# EAGLE schematic fmc-to-vhcdi (EAGLE 8.3.2)
DESIGNER: JON NEWMAN; DESIGN_NAME: FMC TO VHCDI; LICENSE: CC BY-NC-SA 4.0; REVISION: 1.0
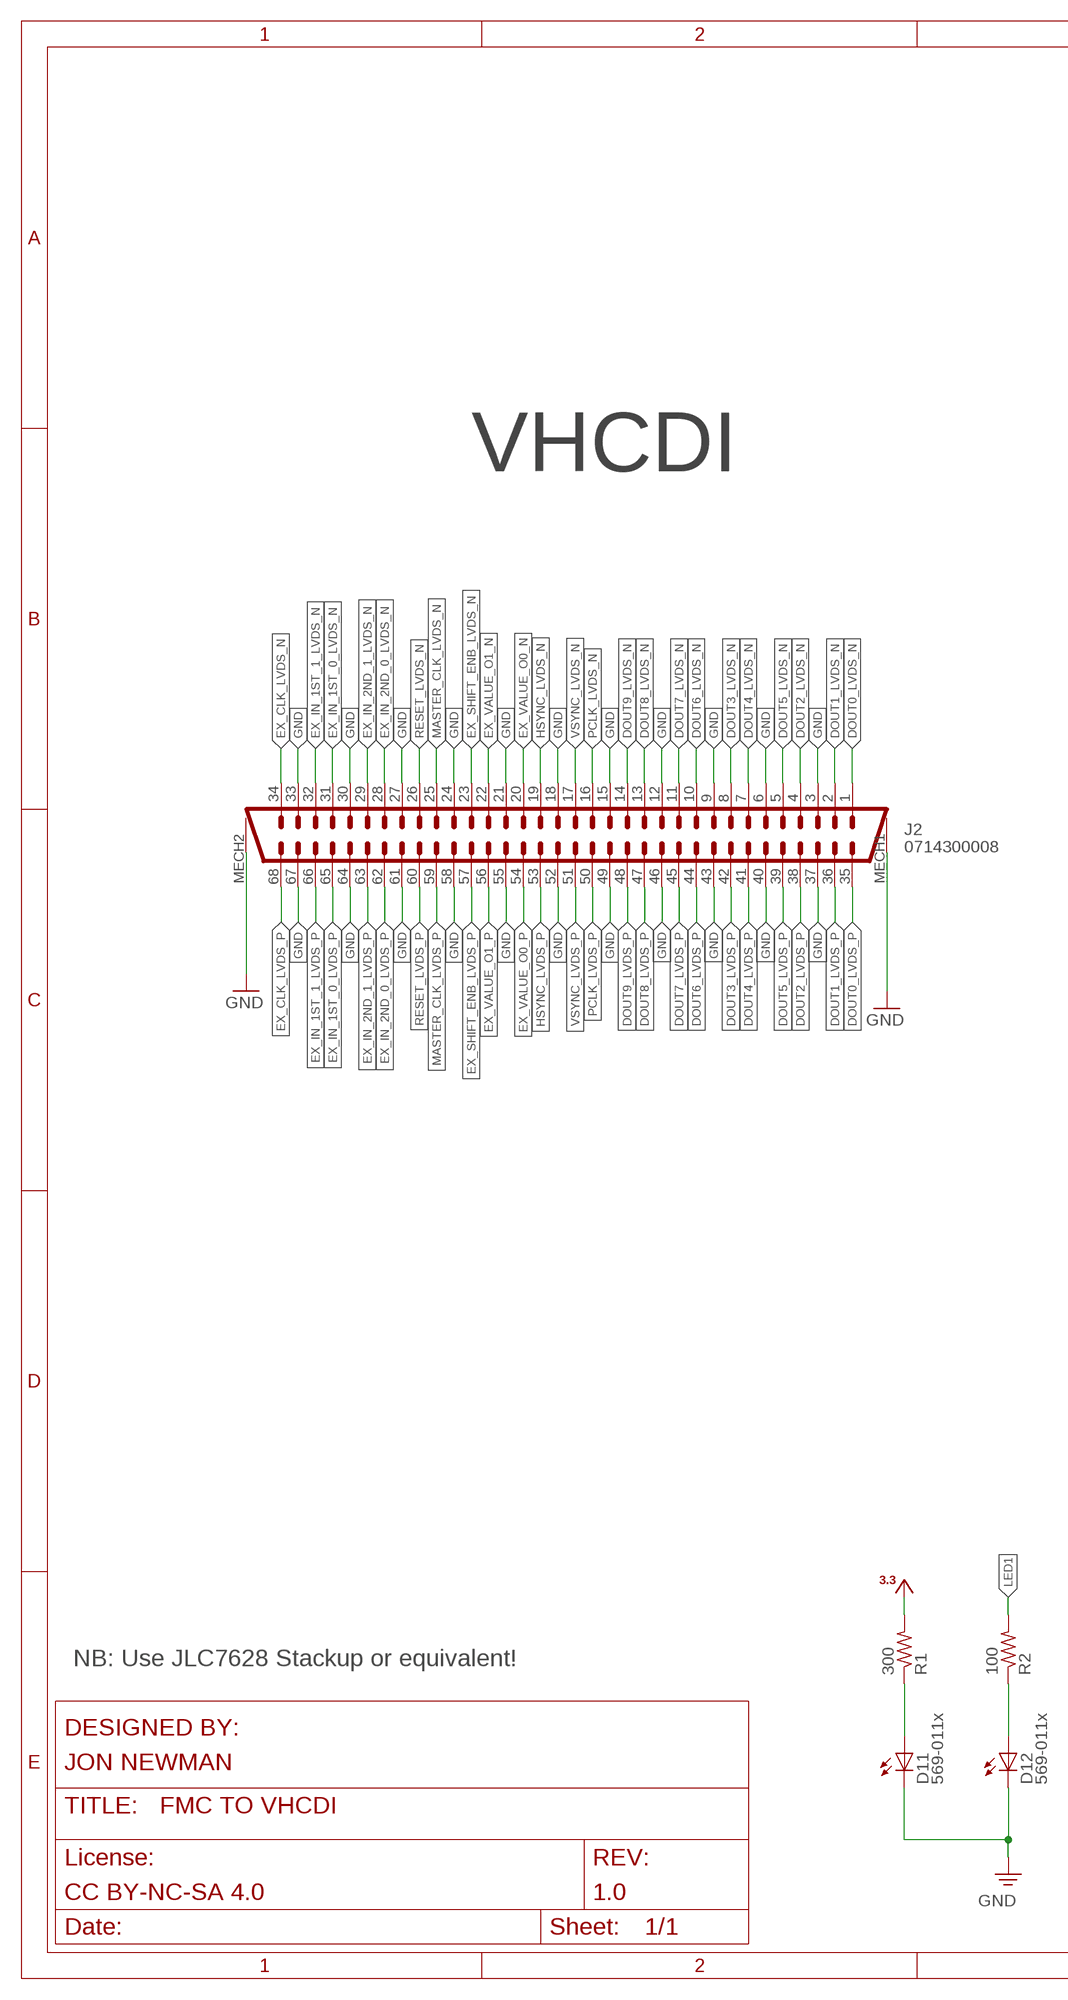
[diagram p0: schematic, sheet 1, part 1 of 2]
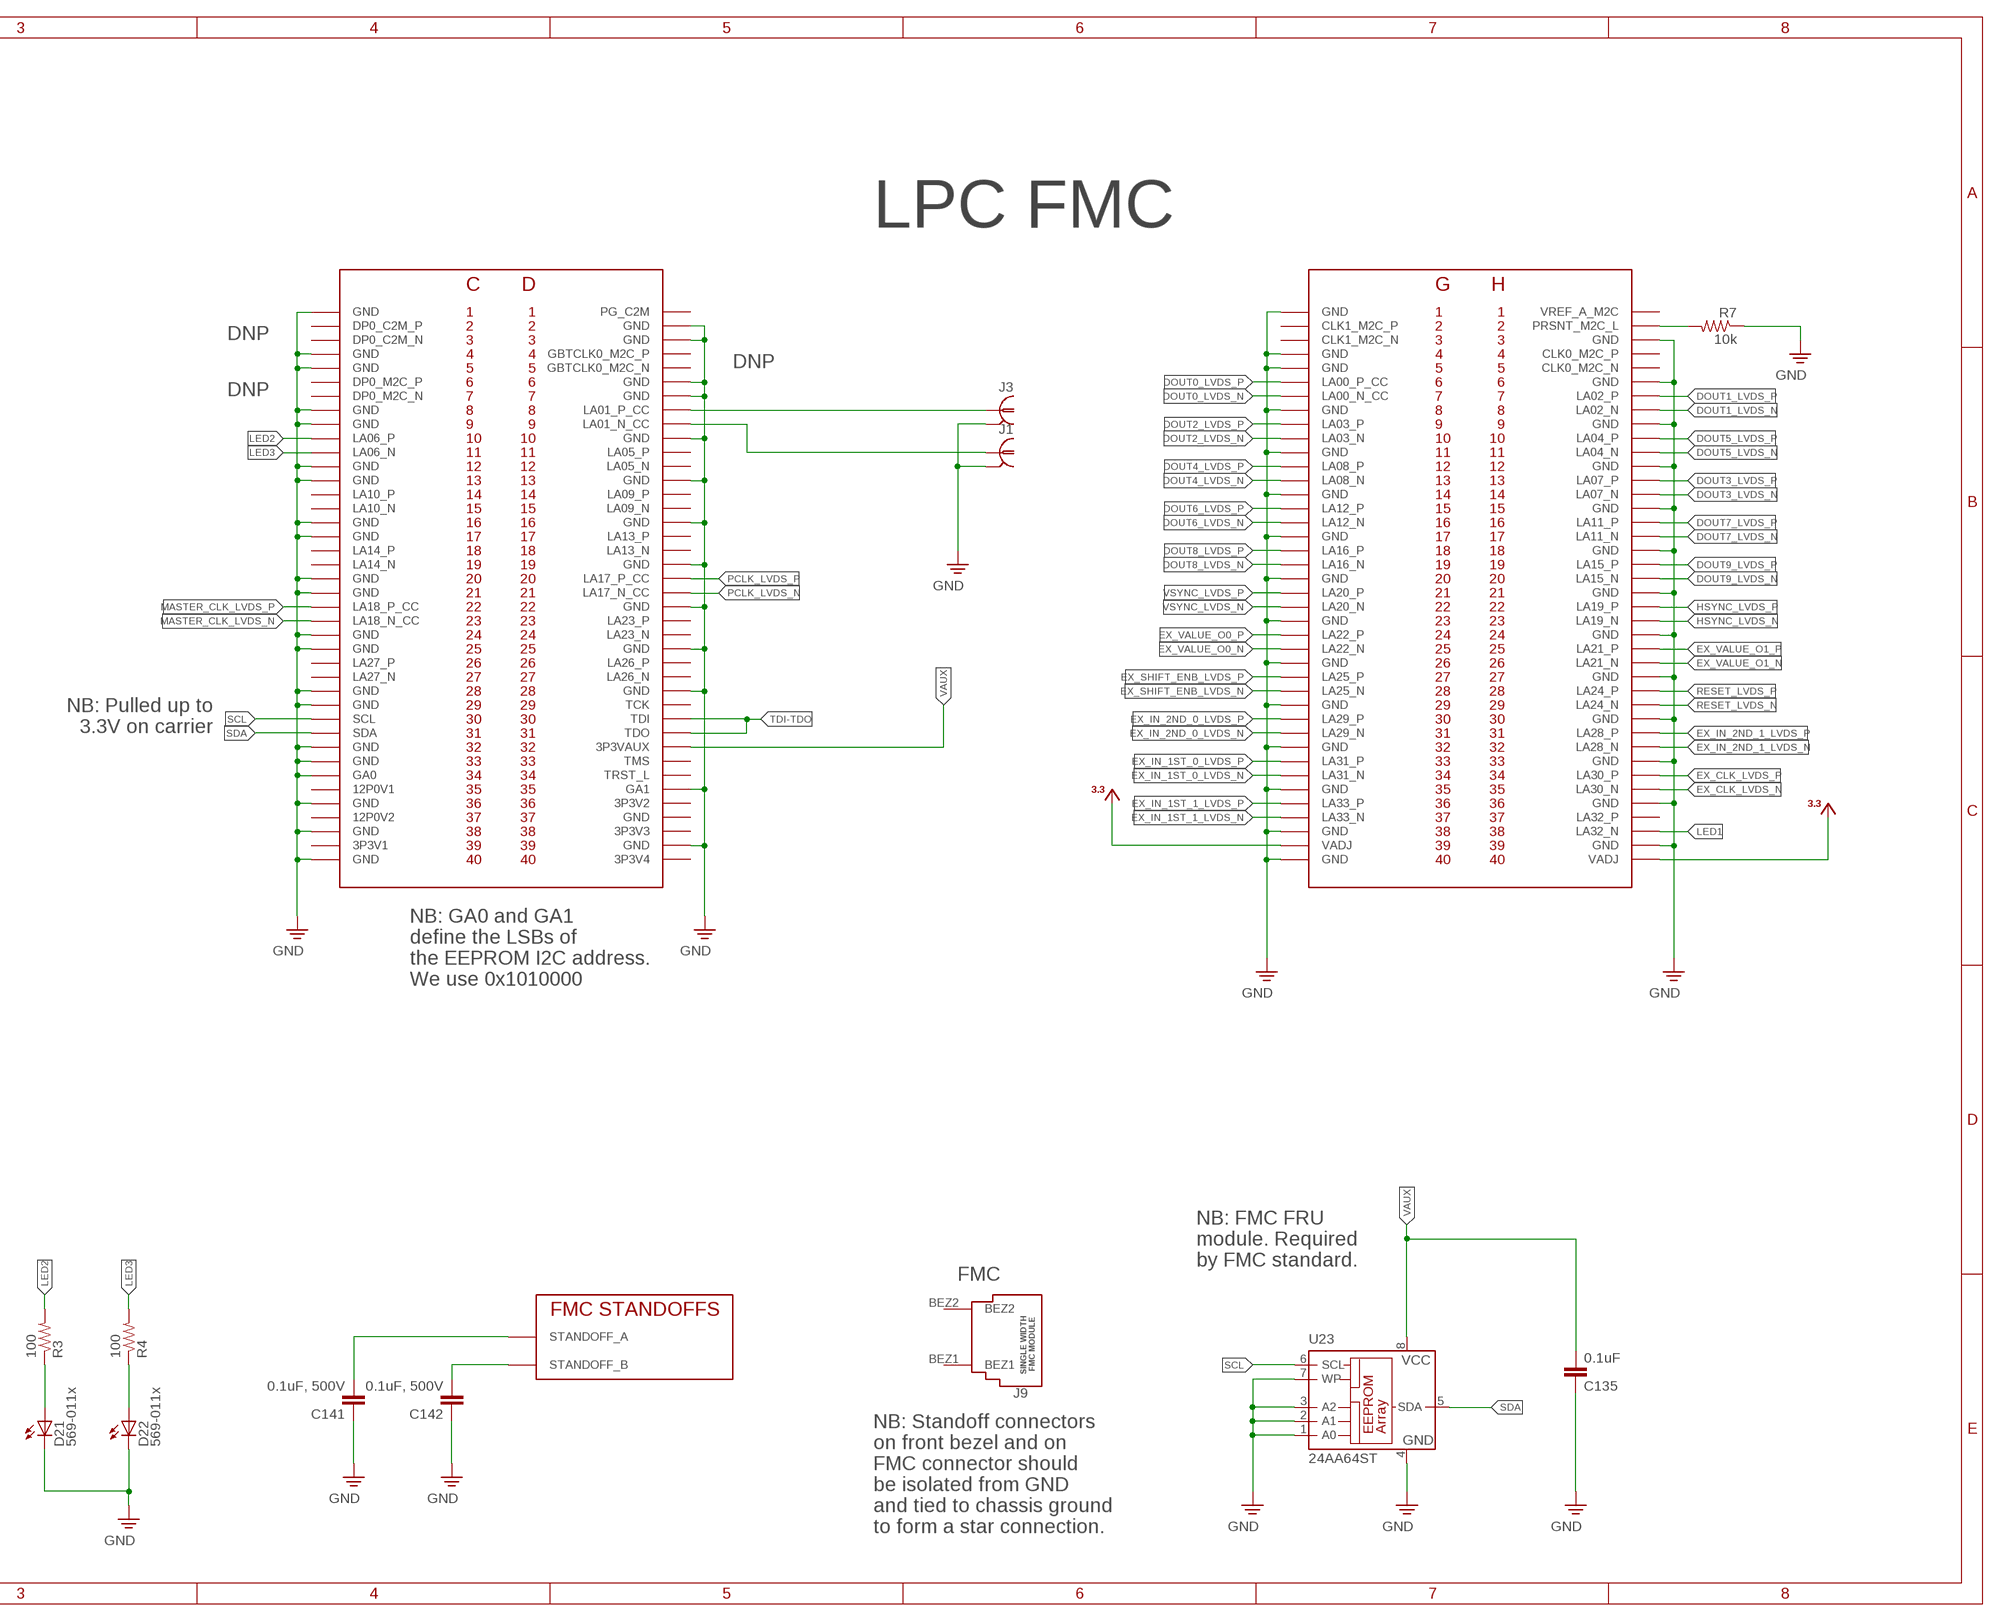
[diagram p1: schematic, sheet 1, part 2 of 2]

## Parts
C135  0.1uF  C_0402  [0402]
C141  0.1uF, 500V  C_1210  [1210]
C142  0.1uF, 500V  C_1210  [1210]
D1  569-011x  LED_2X_WP4060VH/2  [WP4060VH/2GD_LED_ARRAY]
D2  569-011x  LED_2X_WP4060VH/2  [WP4060VH/2GD_LED_ARRAY]
J1  COAX_SMA-VERT  [SMA_JACK_142-0701-201]
J2  0714300008  SCSI-68_TIGHT  [0714300008-TIGHT]
J3  COAX_SMA-VERT  [SMA_JACK_142-0701-201]
J4  FMC_LPC_160_PIN_MALE  [FMC_LPC_MALE]
J9  FMC_SINGLE_WIDTH_MODULE  [FMC_SINGLE_WIDTH_MODULE]
R1  300  R_0402  [0402]
R2  100  R_0402  [0402]
R3  100  R_0402  [0402]
R4  100  R_0402  [0402]
R7  10k  R_0402  [0402]
U23  24AA64ST  [TSSOP8]

## Nets
+3V3: J4.G39(VADJ) J4.H40(VADJ) R1.2
DOUT0_LVDS_N [100 Ohm Diff Top]: J2.1 J4.G7(LA00_N_CC)
DOUT0_LVDS_P [100 Ohm Diff Top]: J2.35 J4.G6(LA00_P_CC)
DOUT1_LVDS_N [100 Ohm Diff Top]: J2.2 J4.H8(LA02_N)
DOUT1_LVDS_P [100 Ohm Diff Top]: J2.36 J4.H7(LA02_P)
DOUT2_LVDS_N [100 Ohm Diff Top]: J2.4 J4.G10(LA03_N)
DOUT2_LVDS_P [100 Ohm Diff Top]: J2.38 J4.G9(LA03_P)
DOUT3_LVDS_N [100 Ohm Diff Top]: J2.8 J4.H14(LA07_N)
DOUT3_LVDS_P [100 Ohm Diff Top]: J2.42 J4.H13(LA07_P)
DOUT4_LVDS_N [100 Ohm Diff Top]: J2.7 J4.G13(LA08_N)
DOUT4_LVDS_P [100 Ohm Diff Top]: J2.41 J4.G12(LA08_P)
DOUT5_LVDS_N [100 Ohm Diff Top]: J2.5 J4.H11(LA04_N)
DOUT5_LVDS_P [100 Ohm Diff Top]: J2.39 J4.H10(LA04_P)
DOUT6_LVDS_N [100 Ohm Diff Top]: J2.10 J4.G16(LA12_N)
DOUT6_LVDS_P [100 Ohm Diff Top]: J2.44 J4.G15(LA12_P)
DOUT7_LVDS_N [100 Ohm Diff Top]: J2.11 J4.H17(LA11_N)
DOUT7_LVDS_P [100 Ohm Diff Top]: J2.45 J4.H16(LA11_P)
DOUT8_LVDS_N [100 Ohm Diff Top]: J2.13 J4.G19(LA16_N)
DOUT8_LVDS_P [100 Ohm Diff Top]: J2.47 J4.G18(LA16_P)
DOUT9_LVDS_N [100 Ohm Diff Top]: J2.14 J4.H20(LA15_N)
DOUT9_LVDS_P [100 Ohm Diff Top]: J2.48 J4.H19(LA15_P)
EX_CLK_LVDS_N [100 Ohm Diff Top]: J2.34 J4.H35(LA30_N)
EX_CLK_LVDS_P [100 Ohm Diff Top]: J2.68 J4.H34(LA30_P)
EX_IN_1ST_0_LVDS_N [100 Ohm Diff Top]: J2.31 J4.G34(LA31_N)
EX_IN_1ST_0_LVDS_P [100 Ohm Diff Top]: J2.65 J4.G33(LA31_P)
EX_IN_1ST_1_LVDS_N [100 Ohm Diff Top]: J2.32 J4.G37(LA33_N)
EX_IN_1ST_1_LVDS_P [100 Ohm Diff Top]: J2.66 J4.G36(LA33_P)
EX_IN_2ND_0_LVDS_N [100 Ohm Diff Top]: J2.28 J4.G31(LA29_N)
EX_IN_2ND_0_LVDS_P [100 Ohm Diff Top]: J2.62 J4.G30(LA29_P)
EX_IN_2ND_1_LVDS_N [100 Ohm Diff Top]: J2.29 J4.H32(LA28_N)
EX_IN_2ND_1_LVDS_P [100 Ohm Diff Top]: J2.63 J4.H31(LA28_P)
EX_SHIFT_ENB_LVDS_N [100 Ohm Diff Top]: J2.23 J4.G28(LA25_N)
EX_SHIFT_ENB_LVDS_P [100 Ohm Diff Top]: J2.57 J4.G27(LA25_P)
EX_VALUE_O0_N [100 Ohm Diff Top]: J2.20 J4.G25(LA22_N)
EX_VALUE_O0_P [100 Ohm Diff Top]: J2.54 J4.G24(LA22_P)
EX_VALUE_O1_N [100 Ohm Diff Top]: J2.22 J4.H26(LA21_N)
EX_VALUE_O1_P [100 Ohm Diff Top]: J2.56 J4.H25(LA21_P)
GND: C135.1 C141.1 C142.1 D1.C1(1:C) D1.C2(2:C) D2.C1(1:C) D2.C2(2:C) J1.GND$1 J1.GND$2 J1.GND$3 J1.GND$4 J2.3 J2.6 J2.9 J2.12 J2.15 J2.18 J2.21 J2.24 J2.27 J2.30 J2.33 J2.37 J2.40 J2.43 J2.46 J2.49 J2.52 J2.55 J2.58 J2.61 J2.64 J2.67 J2.MECH1 J2.MECH2 J3.GND$1 J3.GND$2 J3.GND$3 J3.GND$4 J4.C1(GND) J4.C4(GND) J4.C5(GND) J4.C8(GND) J4.C9(GND) J4.C12(GND) J4.C13(GND) J4.C16(GND) J4.C17(GND) J4.C20(GND) J4.C21(GND) J4.C24(GND) J4.C25(GND) J4.C28(GND) J4.C29(GND) J4.C32(GND) J4.C33(GND) J4.C34(GA0) J4.C36(GND) J4.C38(GND) J4.C40(GND) J4.D2(GND) J4.D3(GND) J4.D6(GND) J4.D7(GND) J4.D10(GND) J4.D13(GND) J4.D16(GND) J4.D19(GND) J4.D22(GND) J4.D25(GND) J4.D28(GND) J4.D35(GA1) J4.D39(GND) J4.G1(GND) J4.G4(GND) J4.G5(GND) J4.G8(GND) J4.G11(GND) J4.G14(GND) J4.G17(GND) J4.G20(GND) J4.G23(GND) J4.G26(GND) J4.G29(GND) J4.G32(GND) J4.G35(GND) J4.G38(GND) J4.G40(GND) J4.H3(GND) J4.H6(GND) J4.H9(GND) J4.H12(GND) J4.H15(GND) J4.H18(GND) J4.H21(GND) J4.H24(GND) J4.H27(GND) J4.H30(GND) J4.H33(GND) J4.H36(GND) J4.H39(GND) R7.1 U23.1(A0) U23.2(A1) U23.3(A2) U23.4(GND) U23.7(WP)
HSYNC_LVDS_N [100 Ohm Diff Top]: J2.19 J4.H23(LA19_N)
HSYNC_LVDS_P [100 Ohm Diff Top]: J2.53 J4.H22(LA19_P)
LED1: J4.H38(LA32_N) R2.2
LED2: J4.C10(LA06_P) R3.2
LED3: J4.C11(LA06_N) R4.2
MASTER_CLK_LVDS_N [100 Ohm Diff Top]: J2.25 J4.C23(LA18_N_CC)
MASTER_CLK_LVDS_P [100 Ohm Diff Top]: J2.59 J4.C22(LA18_P_CC)
N$1: D1.A2(2:A) R2.1
N$2: D2.A1(1:A) R3.1
N$3: D2.A2(2:A) R4.1
N$4: J4.H2(PRSNT_M2C_L) R7.2
N$33: D1.A1(1:A) R1.1
N$51: C142.2 J4.CHASSIS_B(STANDOFF_B)
N$52: C141.2 J4.CHASSIS_A(STANDOFF_A)
PCLK_LVDS_N [100 Ohm Diff Top]: J2.16 J4.D21(LA17_N_CC)
PCLK_LVDS_P [100 Ohm Diff Top]: J2.50 J4.D20(LA17_P_CC)
RESET_LVDS_N [100 Ohm Diff Top]: J2.26 J4.H29(LA24_N)
RESET_LVDS_P [100 Ohm Diff Top]: J2.60 J4.H28(LA24_P)
SCL: J4.C30(SCL) U23.6(SCL)
SDA: J4.C31(SDA) U23.5(SDA)
SMA_N [100 Ohm Diff Top]: J1.CLK J4.D9(LA01_N_CC)
SMA_P [100 Ohm Diff Top]: J3.CLK J4.D8(LA01_P_CC)
TDI-TDO: J4.D30(TDI) J4.D31(TDO)
VAUX: C135.2 J4.D32(3P3VAUX) U23.8(VCC)
VSYNC_LVDS_N [100 Ohm Diff Top]: J2.17 J4.G22(LA20_N)
VSYNC_LVDS_P [100 Ohm Diff Top]: J2.51 J4.G21(LA20_P)
Unconnected: J4.C2(DP0_C2M_P) J4.C3(DP0_C2M_N) J4.C6(DP0_M2C_P) J4.C7(DP0_M2C_N) J4.C14(LA10_P) J4.C15(LA10_N) J4.C18(LA14_P) J4.C19(LA14_N) J4.C26(LA27_P) J4.C27(LA27_N) J4.C35(12P0V1) J4.C37(12P0V2) J4.C39(3P3V1) J4.D1(PG_C2M) J4.D4(GBTCLK0_M2C_P) J4.D5(GBTCLK0_M2C_N) J4.D11(LA05_P) J4.D12(LA05_N) J4.D14(LA09_P) J4.D15(LA09_N) J4.D17(LA13_P) J4.D18(LA13_N) J4.D23(LA23_P) J4.D24(LA23_N) J4.D26(LA26_P) J4.D27(LA26_N) J4.D29(TCK) J4.D33(TMS) J4.D34(TRST_L) J4.D36(3P3V2) J4.D38(3P3V3) J4.D40(3P3V4) J4.G2(CLK1_M2C_P) J4.G3(CLK1_M2C_N) J4.H1(VREF_A_M2C) J4.H4(CLK0_M2C_P) J4.H5(CLK0_M2C_N) J4.H37(LA32_P) J9.BEZ1 J9.BEZ2

## Notes on the sheet
- LPC FMC
- DNP
- DNP
- VHCDI | DNP
- NB: Pulled up to
  3.3V on carrier
- NB: GA0 and GA1 
  define the LSBs of 
  the EEPROM I2C address.
  We use 0x1010000
- NB: FMC FRU 
  module. Required 
  by FMC standard.
- FMC
- NB: Use JLC7628 Stackup or equivalent!
- NB: Standoff connectors
  on front bezel and on 
  FMC connector should
  be isolated from GND
  and tied to chassis ground
  to form a star connection.

## Power pins joined to a net without a drawn wire
GND: J4.D37(GND)

## Library data of the parts
C135 C141 C142 = jonnew:C: Capacitor
D1 D2 = jonnew:LED_2X
J1 J3 = jonnew:COAX: COAX CONNECTOR - Edge mount BNC - Vertical BNC - Vertical SMA - etc
J2 = jonnew:SCSI-68
J4 = jonnew:FMC_LPC_160_PIN
J9 = jonnew:FMC_SINGLE_WIDTH_MODULE
R1-R4 R7 = jonnew:R: Resistor
U23 = jonnew:24*: Serial EEPROM I2C; MPN: 25AA640A-I/ST; OC_FARNELL: 1818513; OC_NEWARK: 27M1300

## Net classes
1 100 Ohm Diff Top: width 0.25 mm, drill 0.2 mm, clearance 0.09 mm